# EAGLE schematic MicroMouseMain (EAGLE 9.6.2)
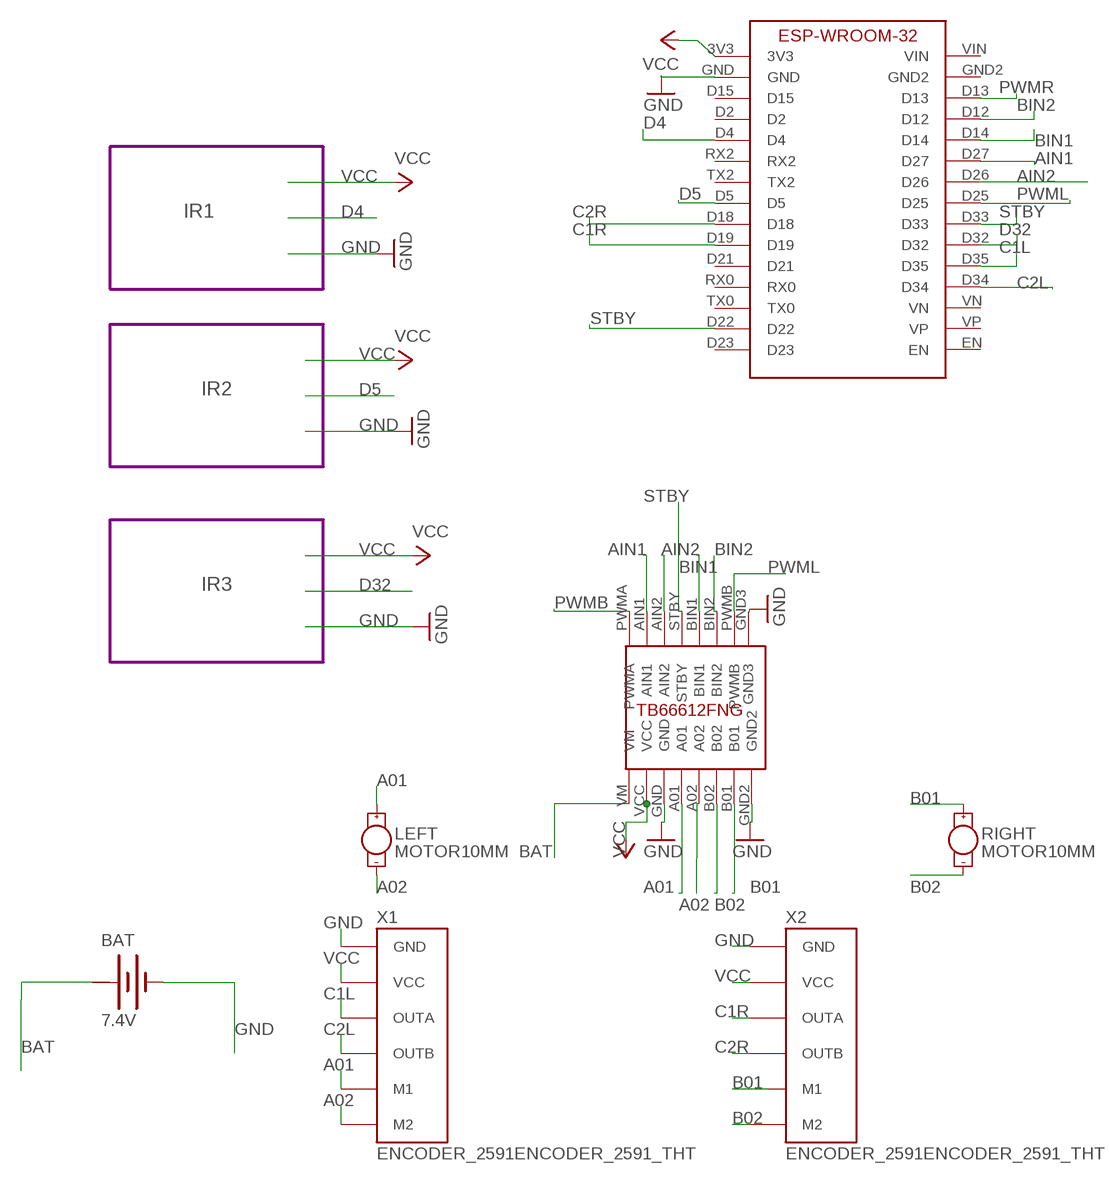
[diagram p0: schematic, sheet 1]

## Parts
BAT  7.4V  BATTERY  [BATTERY]
LEFT  MOTOR10MM  [VIBE-MOTOR-10MM]
RIGHT  MOTOR10MM  [VIBE-MOTOR-10MM]
U$1  TB66612FNG  [TB66612FNG]
U$2  ESP-WROOM-32-WOBLE  [ESP-WROOM-32-WOBLE]
X1  ENCODER_2591ENCODER_2591_THT  [ENCODER_2591_THT]
X2  ENCODER_2591ENCODER_2591_THT  [ENCODER_2591_THT]

## Module instances
IR1 = IR
IR2 = IR
IR3 = IR

## Nets
A01: LEFT.+ U$1.A01 X1.M1
A02: LEFT.- U$1.A02 X1.M2
AIN1: U$1.AIN1 U$2.D27
AIN2: U$1.AIN2 U$2.D26
B01: RIGHT.+ U$1.B01 X2.M1
B02: RIGHT.- U$1.B02 X2.M2
BAT: BAT.+ U$1.VM
BIN1: U$1.BIN1 U$2.D14
BIN2: U$1.BIN2 U$2.D12
C1L: U$2.D35 X1.OUTA
C1R: U$2.D19 X2.OUTA
C2L: U$2.D34 X1.OUTB
C2R: U$2.D18 X2.OUTB
D4: U$2.D4
D5: U$2.D5
D32: U$2.D32
GND: BAT.- U$1.GND U$1.GND2 U$1.GND3 U$2.GND X1.GND X2.GND
PWMB: U$1.PWMA
PWML: U$1.PWMB U$2.D25
PWMR: U$2.D13
STBY: U$1.STBY U$2.D22 U$2.D33
VCC: U$1.VCC U$2.3V3 X1.VCC X2.VCC
Unconnected: U$2.D2 U$2.D15 U$2.D21 U$2.D23 U$2.EN U$2.GND2 U$2.RX0 U$2.RX2 U$2.TX0 U$2.TX2 U$2.VIN U$2.VN U$2.VP

## Power pins joined to a net without a drawn wire
+: BAT.+@1(+)

## Library data of the parts
BAT = special:BATTERY: BATTERY
LEFT RIGHT = SparkFun-Electromechanical:MOTOR: Motor (Single-Phase) Two-terminal, single-phase motors. SparkFun Products Vibration Motor <https://www.sparkfun.com/products/8449> (ROB-08449) Physical dimension and wire connections for this powerful vibration motor. Motor has a self adhesive backing.; PROD_ID: COMP-08572; SF_SKU: ROB-08449
U$1 = TB66612FNG:TB66612FNG
U$2 = ESP-WROOM-32-WOBLE:ESP-WROOM-32-WOBLE
X1 X2 = Pololu Encoder and Motor Driver:ENCODER_2591

## Module IR
Ports: 

### Library data of the parts